# Altium schematic sheet Block Diagram.SchDoc
size A4; SheetNumber: 2; SheetTotal: 7
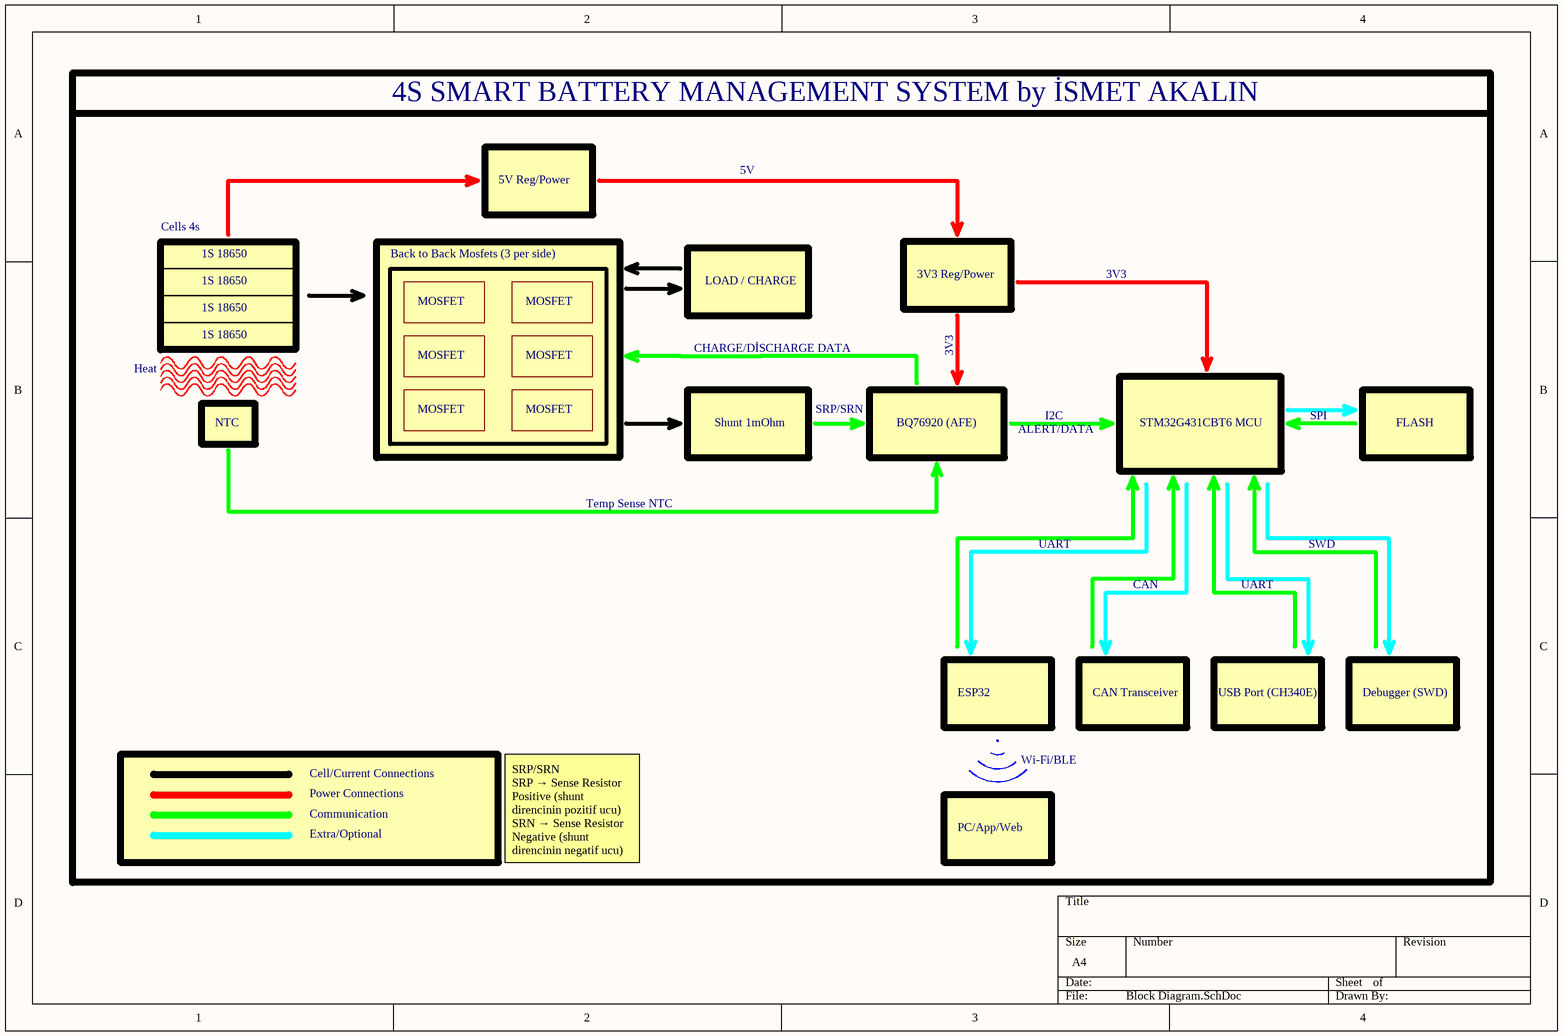
[diagram p0: Block Diagram.SchDoc]

## Notes on the sheet
- 4S SMART BATTERY MANAGEMENT SYSTEM by İSMET AKALIN
- 5V
- Cells 4s
- 5V Reg/Power
- 1S 18650
- Back to Back Mosfets (3 per side)
- MOSFET
- LOAD / CHARGE
- 3V3 Reg/Power
- 3V3
- Heat
- CHARGE/DİSCHARGE DATA
- NTC
- Shunt 1mOhm
- SRP/SRN
- BQ76920 (AFE)
- ALERT/DATA
- I2C
- STM32G431CBT6 MCU
- SPI
- FLASH
- Temp Sense NTC
- UART
- SWD
- CAN
- ESP32
- CAN Transceiver
- USB Port (CH340E)
- Debugger (SWD)
- Cell/Current Connections
- Wi-Fi/BLE
- Extra/Optional
- Communication
- Power Connections
- PC/App/Web
- SRP/SRN                   SRP → Sense Resistor Positive (shunt direncinin pozitif ucu)   SRN → Sense Resistor Negative (shunt direncinin negatif ucu)